# EAGLE design fetmatcher (EAGLE 8.7.0)
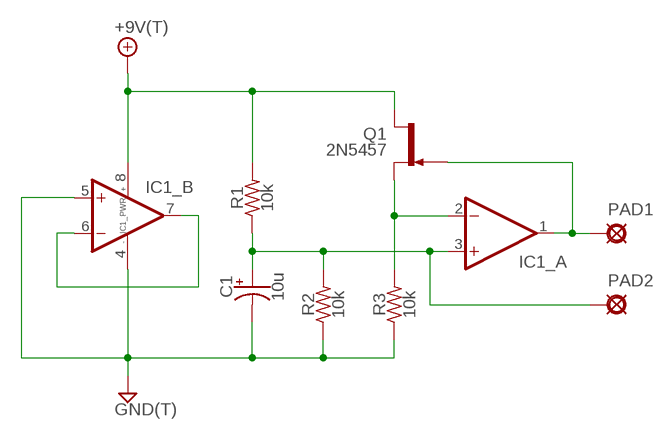
[diagram p0: schematic, sheet 1]

## Parts
+9V1  +9V(T)  [SQUARE]
C1  10u  0501  [050_020_1]
GND1  GND(T)  [SQUARE]
IC1  DUALTH  [DIL0]
PAD1  PAD  [SQUARE]
PAD2  PAD  [SQUARE]
Q1  2N5457  [TO92-]
R1  10k  R_.3B  [R0207/3]
R2  10k  R_.3B  [R0207/3]
R3  10k  R_.3B  [R0207/3]

## Nets
+9V: +9V1.1(+9V) IC1.8(_PWR:V+) Q1.3(D) R1.2
GND: C1.- GND1.1(GND) IC1.4(_PWR:V-) IC1.5(_B:+IN) R2.1 R3.1
N$1: IC1.6(_B:-IN) IC1.7(_B:OUT)
N$2: IC1.2(_A:-IN) Q1.2(S) R3.2
N$3: C1.+ IC1.3(_A:+IN) PAD2.1(PAD) R1.1 R2.2
N$4: IC1.1(_A:OUT) PAD1.1(PAD) Q1.1(G)

## Library data of the parts
+9V1 = pedals-supply:+9V(T): +9V Voltage Supply use this to hook up +9v throughout a schematic instead of running wire automatically labels the net "+9v" adds a hookup pad to the circuit board
C1 = pedals-capacitors-elec:050
GND1 = pedals-supply:GND(T): Ground use this to hook up ground (GND) throughout a schematic instead of running wire automatically labels the net "GND" adds a hookup pad to the circuit board (you can use several)
IC1 = pedals-integrated circuits:DUAL: OP AMP
PAD1 PAD2 = pedals-supply:PAD: PAD use this package for pads with any purpose, including input, output, send or return various pad shapes: round, square, octogonal, long, and long offset
Q1 = pedals-transistors:2N5457: N-CHANNEL JFET
R1-R3 = pedals-resistors:R_

## Board
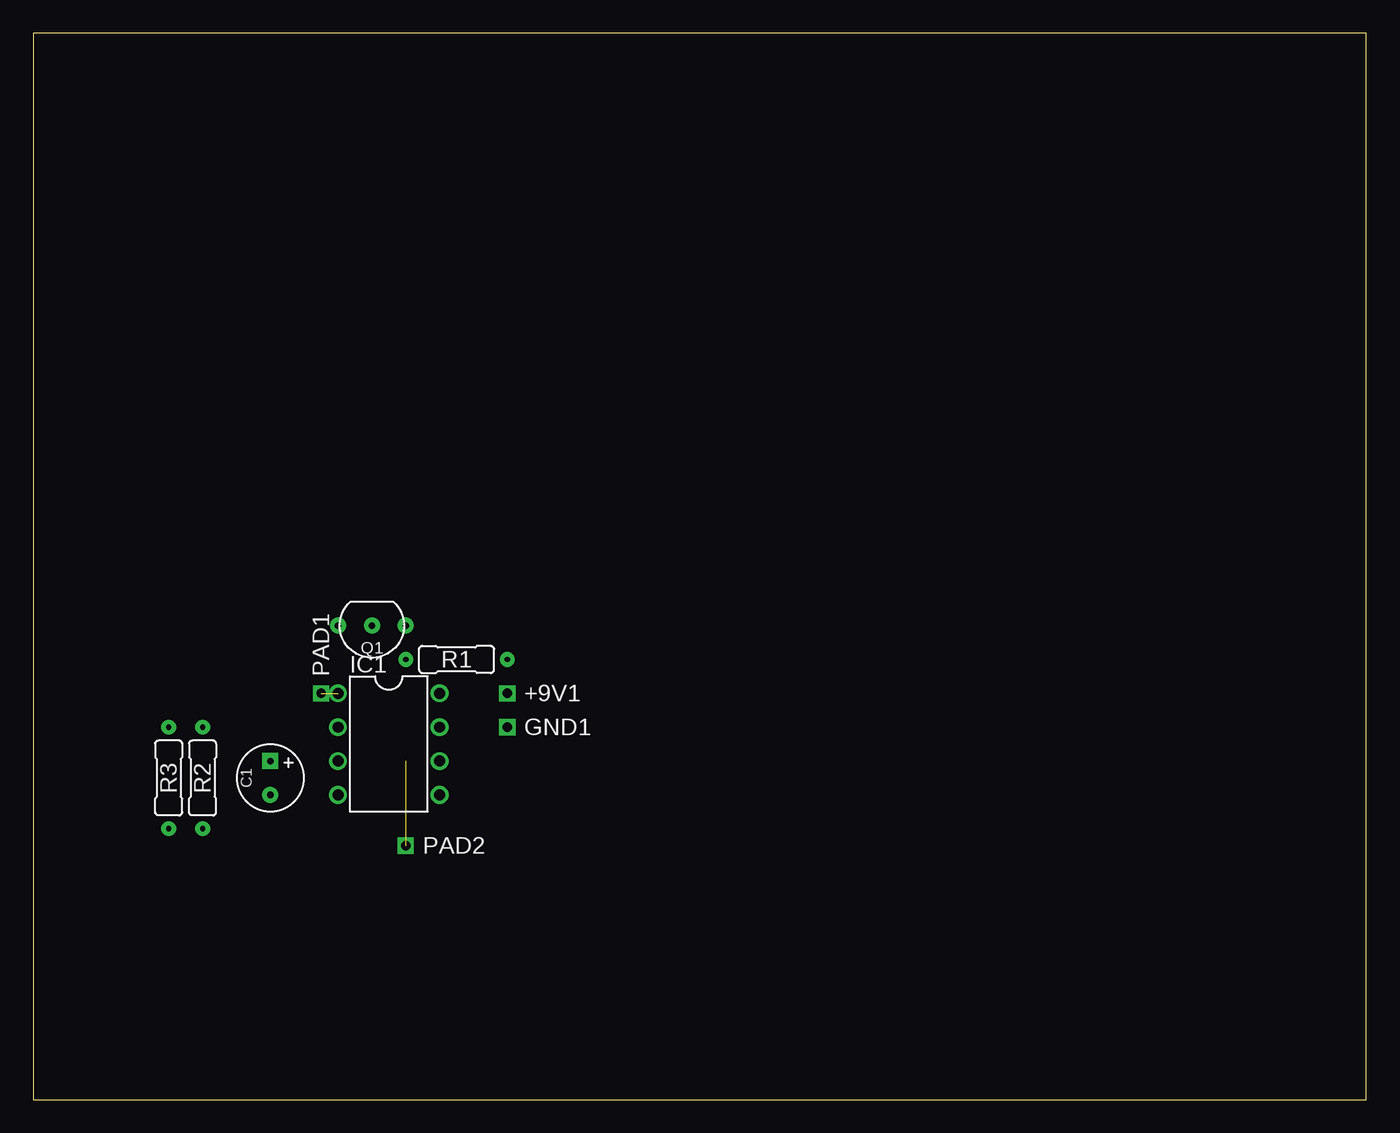
[diagram p1: board, top side]
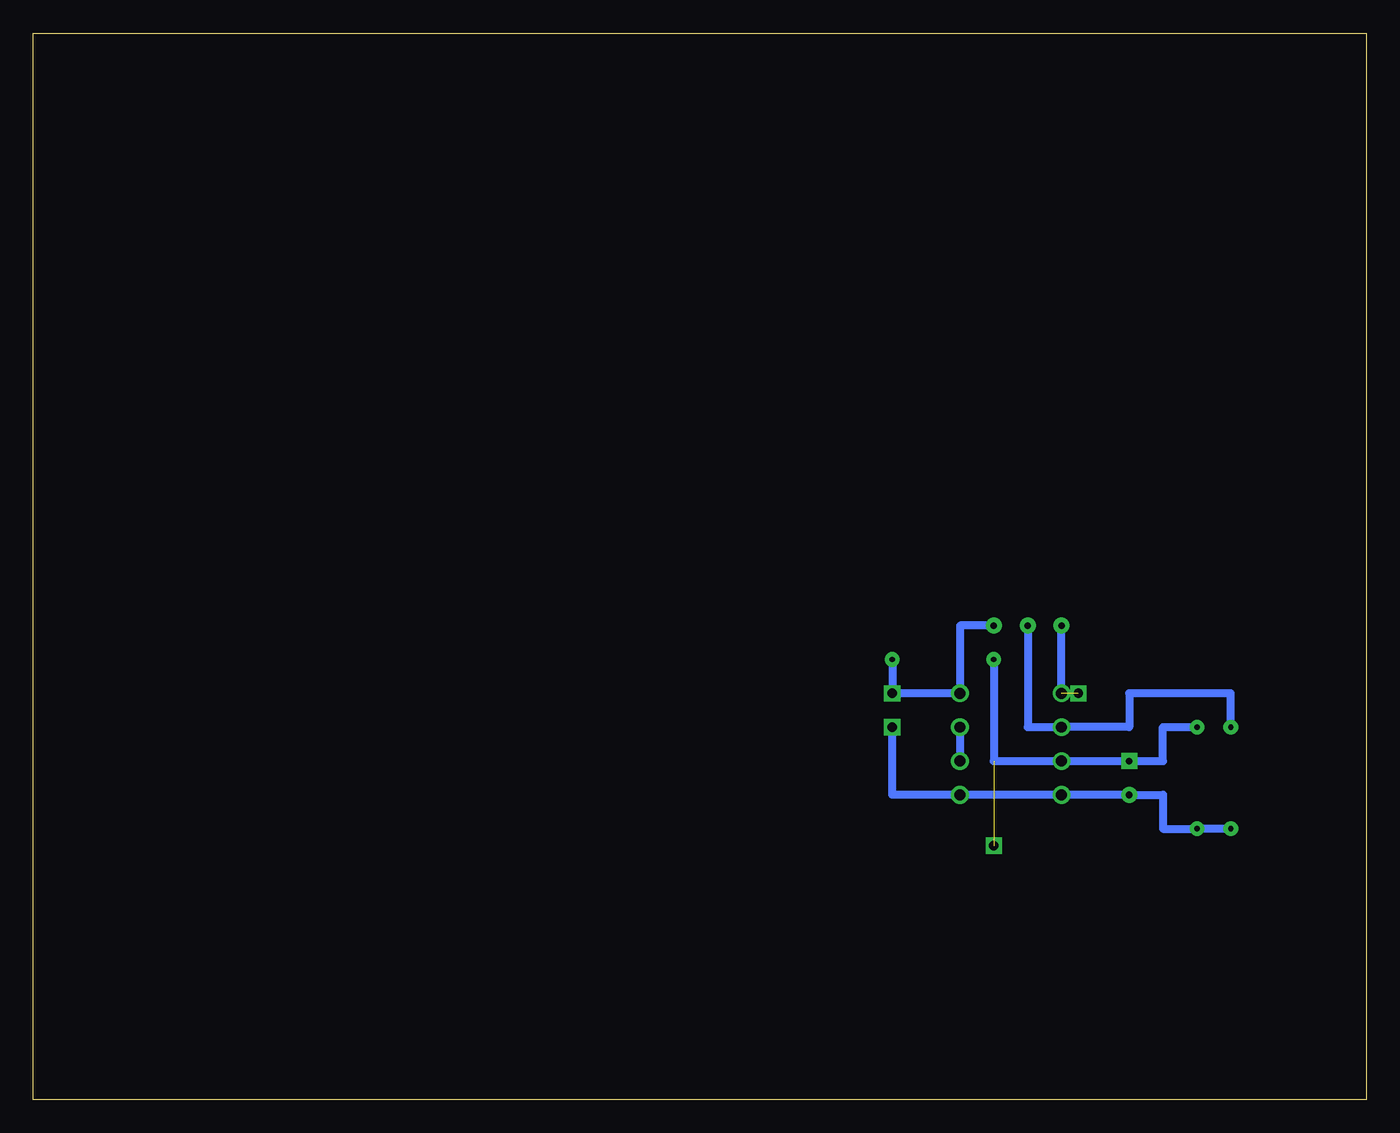
[diagram p2: board, bottom side, seen from below]

Size 100 x 80 mm. Coordinates in mm from the lower left corner, seen from the top.
Outline: 0,0 100,0 100,80 0,80 0,0
Copper layers (1*16): Top 0.035mm / dielectric 1.5mm / Bottom 0.035mm
Design rules "default": minimum track width 6mil, minimum drill 0.35mm, track to track 6mil, track to pad 6mil, pad to pad 6mil, via to via 6mil, smd to smd 6mil, copper to edge 40mil, drill to drill 6mil, minimum pad ring 10mil, minimum via ring 8mil, stop-mask expansion 4mil, vias tented up to drill 0mil, thermal gap 10mil

### Footprints (pad centres in the part's own frame; a part is rotated, then mirrored left to right if it is on the bottom)
SQUARE = drill 0.7 square: 1 0,0
050_020_1 = drill 0.5 pad 1.2 square: + -1.27,0 | drill 0.5 pad 1.2: - 1.27,0
DIL0 = drill 0.813 pad 1.27: 1 -3.81,-3.81; 2 -1.27,-3.81; 3 1.27,-3.81; 4 3.81,-3.81; 5 3.81,3.81; 6 1.27,3.81; 7 -1.27,3.81; 8 -3.81,3.81
TO92- = drill 0.5 pad 1.2: 1 2.54,0; 2 0,0; 3 -2.54,0
R0207/3 = drill 0.4 pad 1.1: 1 -3.81,0; 2 3.81,0

### Placement (x,y rotation side)
+9V1  35.56,30.48 0 top
C1  17.78,24.13 270 top
GND1  35.56,27.94 0 top
IC1  26.67,26.67 270 top
PAD1  21.59,30.48 90 top
PAD2  27.94,19.05 0 top
Q1  25.4,35.56 180 top
R1  31.75,33.02 0 top
R2  12.7,24.13 90 top
R3  10.16,24.13 90 top

### Tracks (layer width: path | path; a pad name or v marks a point on that pad's centre or on a via)
+9V
  Bottom 0.61: Q1.3 30.48,35.56 IC1.8 +9V1.1 R1.2
GND
  Bottom 0.61: R3.1 R2.1 15.24,20.32 15.24,22.86 C1.- IC1.4 IC1.5 35.56,22.86 GND1.1
N$1
  Bottom 0.61: IC1.7 IC1.6
N$2
  Bottom 0.61: Q1.2 25.4,27.94 IC1.2 17.78,27.94 17.78,30.48 10.16,30.48 R3.2
N$3  (1 unrouted)
  Bottom 0.61: R1.1 27.94,25.4 IC1.3 C1.+ 15.24,25.4 15.24,27.94 R2.2
N$4  (1 unrouted)
  Bottom 0.61: IC1.1 Q1.1